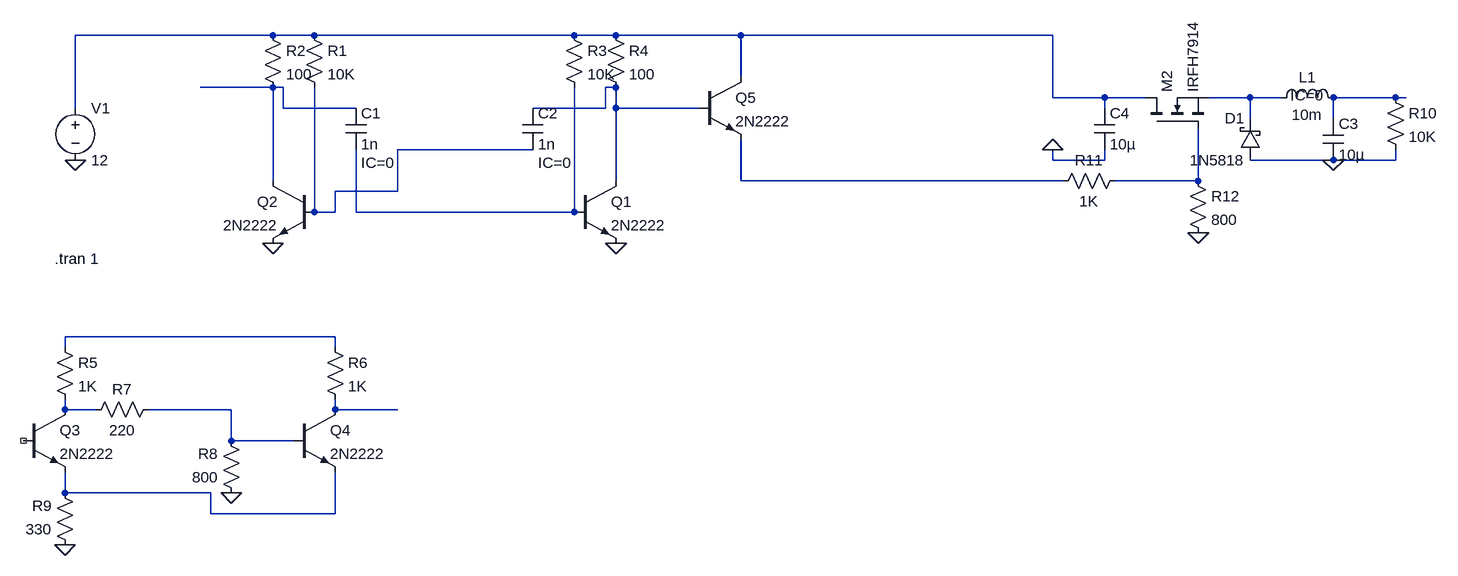
[diagram p0: schematic buck_converter.asc]
buck_converter.asc, the LTspice schematic file:
Version 4
SHEET 1 1588 680
WIRE -416 -144 -720 -144
WIRE -352 -144 -416 -144
WIRE 48 -144 -352 -144
WIRE 112 -144 48 -144
WIRE 304 -144 112 -144
WIRE 784 -144 304 -144
WIRE 304 -80 304 -144
WIRE -416 -64 -528 -64
WIRE -400 -64 -416 -64
WIRE 112 -64 96 -64
WIRE 784 -48 784 -144
WIRE 864 -48 784 -48
WIRE 928 -48 864 -48
WIRE 1088 -48 1024 -48
WIRE 1136 -48 1088 -48
WIRE 1312 -48 1216 -48
WIRE 1328 -48 1312 -48
WIRE -720 -32 -720 -144
WIRE -400 -32 -400 -64
WIRE -288 -32 -400 -32
WIRE 96 -32 96 -64
WIRE 96 -32 -16 -32
WIRE 112 -32 112 -64
WIRE 240 -32 112 -32
WIRE 864 -32 864 -48
WIRE 1088 -16 1088 -48
WIRE 1216 -16 1216 -48
WIRE -16 32 -224 32
WIRE 784 48 784 32
WIRE 864 48 864 32
WIRE 864 48 784 48
WIRE 1216 48 1088 48
WIRE 1312 48 1312 32
WIRE 1312 48 1216 48
WIRE -416 80 -416 -64
WIRE 112 80 112 -32
WIRE 304 80 304 16
WIRE 800 80 304 80
WIRE 1008 80 1008 0
WIRE 1008 80 880 80
WIRE -224 96 -224 32
WIRE -224 96 -320 96
WIRE -352 128 -352 -64
WIRE -352 128 -368 128
WIRE -320 128 -320 96
WIRE -320 128 -352 128
WIRE -288 128 -288 32
WIRE 48 128 48 -64
WIRE 48 128 -288 128
WIRE -320 320 -736 320
WIRE -736 336 -736 320
WIRE -320 336 -320 320
WIRE -736 432 -736 416
WIRE -688 432 -736 432
WIRE -480 432 -608 432
WIRE -320 432 -320 416
WIRE -224 432 -320 432
WIRE -480 480 -480 432
WIRE -384 480 -480 480
WIRE -736 560 -736 528
WIRE -512 560 -736 560
WIRE -512 592 -512 560
WIRE -320 592 -320 528
WIRE -320 592 -512 592
FLAG -416 176 0
FLAG 112 176 0
FLAG -720 48 0
FLAG -736 640 0
FLAG -480 560 0
FLAG 784 32 0
FLAG 1216 48 0
FLAG 1008 160 0
SYMBOL npn 48 80 R0
SYMATTR InstName Q1
SYMATTR Value 2N2222
SYMBOL npn -352 80 M0
SYMATTR InstName Q2
SYMATTR Value 2N2222
SYMBOL res -368 -160 R0
SYMATTR InstName R1
SYMATTR Value 10K
SYMATTR SpiceLine tol=1 pwr=500m
SYMBOL res -432 -160 R0
SYMATTR InstName R2
SYMATTR Value 100
SYMATTR SpiceLine tol=1 pwr=500m
SYMBOL res 32 -160 R0
SYMATTR InstName R3
SYMATTR Value 10K
SYMATTR SpiceLine tol=1 pwr=500m
SYMBOL res 96 -160 R0
SYMATTR InstName R4
SYMATTR Value 100
SYMATTR SpiceLine tol=1 pwr=500m
SYMBOL cap -304 -32 R0
WINDOW 39 24 84 Left 2
SYMATTR SpiceLine IC=0
SYMATTR InstName C1
SYMATTR Value 1n
SYMBOL cap -32 -32 R0
WINDOW 123 24 84 Left 2
SYMATTR Value2 IC=0
SYMATTR InstName C2
SYMATTR Value 1n
SYMBOL voltage -720 -48 R0
WINDOW 123 0 0 Left 0
WINDOW 39 0 0 Left 0
SYMATTR InstName V1
SYMATTR Value 12
SYMBOL npn -800 432 R0
SYMATTR InstName Q3
SYMATTR Value 2N2222
SYMBOL npn -384 432 R0
SYMATTR InstName Q4
SYMATTR Value 2N2222
SYMBOL res -752 320 R0
SYMATTR InstName R5
SYMATTR Value 1K
SYMATTR SpiceLine tol=1 pwr=500m
SYMBOL res -336 320 R0
SYMATTR InstName R6
SYMATTR Value 1K
SYMATTR SpiceLine tol=1 pwr=500m
SYMBOL res -592 416 R90
WINDOW 0 0 56 VBottom 2
WINDOW 3 32 56 VTop 2
SYMATTR InstName R7
SYMATTR Value 220
SYMATTR SpiceLine tol=1 pwr=500m
SYMBOL res -464 576 R180
WINDOW 0 36 76 Left 2
WINDOW 3 36 40 Left 2
SYMATTR InstName R8
SYMATTR Value 800
SYMATTR SpiceLine tol=1 pwr=500m
SYMBOL res -720 656 R180
WINDOW 0 36 76 Left 2
WINDOW 3 36 40 Left 2
SYMATTR InstName R9
SYMATTR Value 330
SYMATTR SpiceLine tol=1 pwr=500m
SYMBOL schottky 1104 48 R180
WINDOW 0 24 64 Left 2
WINDOW 3 24 0 Left 2
SYMATTR InstName D1
SYMATTR Value 1N5818
SYMBOL ind 1120 -32 R270
WINDOW 0 32 56 VTop 2
WINDOW 3 5 56 VBottom 2
WINDOW 39 4 56 VTop 2
SYMATTR InstName L1
SYMATTR Value 10m
SYMATTR SpiceLine IC=0
SYMBOL cap 1200 -16 R0
SYMATTR InstName C3
SYMATTR Value 10µ
SYMATTR SpiceLine IC=0
SYMBOL res 1296 -64 R0
SYMATTR InstName R10
SYMATTR Value 10K
SYMATTR SpiceLine tol=1 pwr=1
SYMBOL nmos 928 0 R270
SYMATTR InstName M2
SYMATTR Value IRFH7914
SYMBOL res 896 64 R90
WINDOW 0 0 56 VBottom 2
WINDOW 3 32 56 VTop 2
SYMATTR InstName R11
SYMATTR Value 1K
SYMATTR SpiceLine tol=1 pwr=0.5
SYMBOL res 992 64 R0
SYMATTR InstName R12
SYMATTR Value 800
SYMATTR SpiceLine tol=1 pwr=0.5
SYMBOL npn 240 -80 R0
SYMATTR InstName Q5
SYMATTR Value 2N2222
SYMBOL cap 848 -32 R0
SYMATTR InstName C4
SYMATTR Value 10µ
SYMATTR SpiceLine IC=0
TEXT -752 200 Left 2 !.tran 1

The netlist it stands for:
* buck_converter.asc
Q1 N003 N009 0 0 2N2222
Q2 N002 N006 0 0 2N2222
R1 N001 N006 10K tol=1 pwr=500m
R2 N001 N002 100 tol=1 pwr=500m
R3 N001 N009 10K tol=1 pwr=500m
R4 N001 N003 100 tol=1 pwr=500m
C1 N002 N009 1n IC=0
C2 N003 N006 1n IC=0
V1 N001 0 12
Q3 N011 NC_01 N014 0 2N2222
Q4 N013 N012 N014 0 2N2222
R5 N010 N011 1K tol=1 pwr=500m
R6 N010 N013 1K tol=1 pwr=500m
R7 N012 N011 220 tol=1 pwr=500m
R8 0 N012 800 tol=1 pwr=500m
R9 0 N014 330 tol=1 pwr=500m
D1 0 N004 1N5818
L1 N004 N005 10m IC=0
C3 N005 0 10µ IC=0
R10 N005 0 10K tol=1 pwr=1
M2 N001 N008 N004 N004 IRFH7914
R11 N008 N007 1K tol=1 pwr=0.5
R12 N008 0 800 tol=1 pwr=0.5
Q5 N001 N003 N007 0 2N2222
C4 N001 0 10µ IC=0
.model D D
.lib standard.dio
.model NPN NPN
.model PNP PNP
.lib standard.bjt
.model NMOS NMOS
.model PMOS PMOS
.lib standard.mos
.tran 1
.backanno
.end